# EAGLE schematic ESP_CAM_VVN (EAGLE 9.6.2)
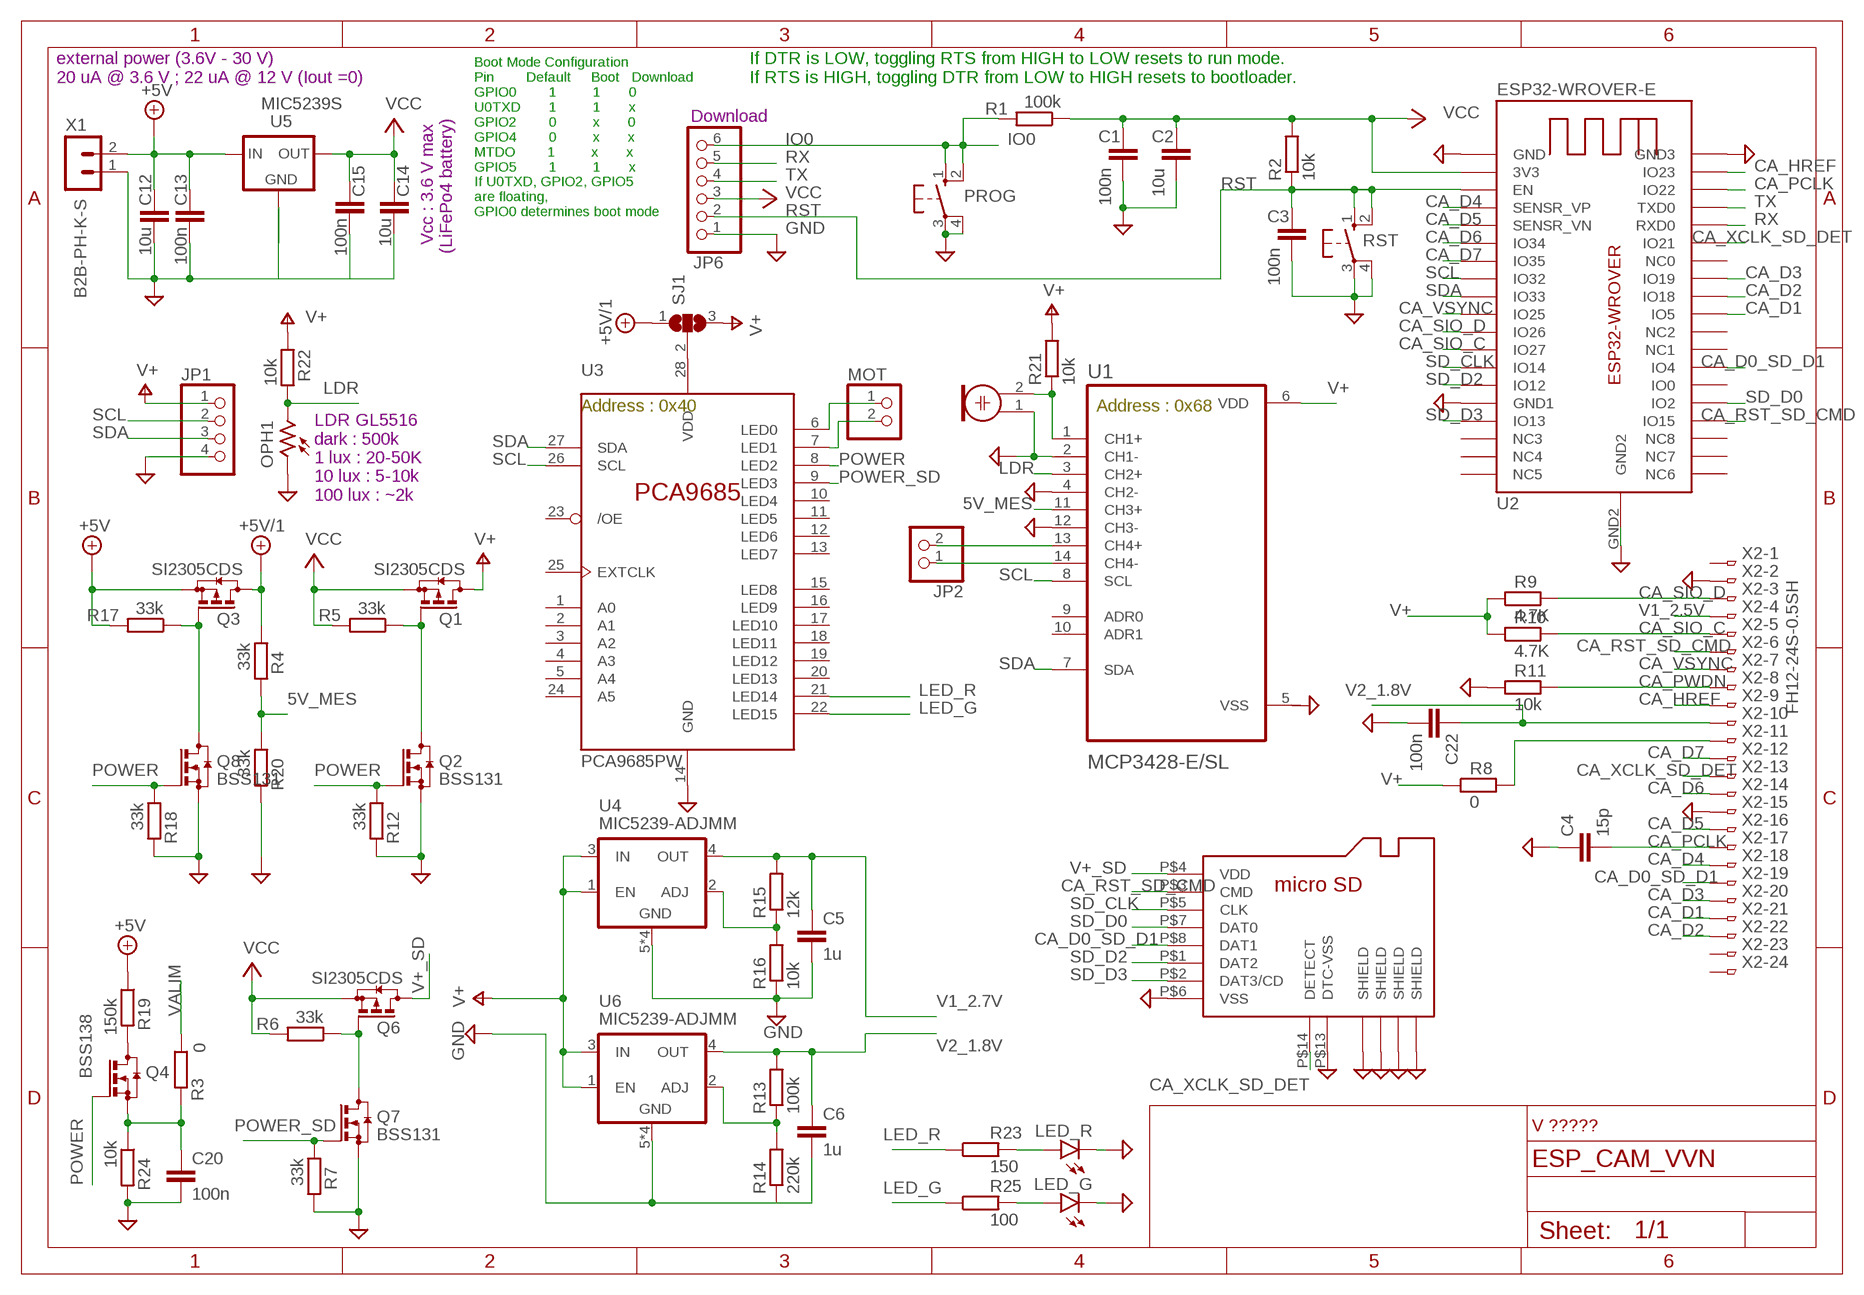
[diagram p0: schematic, sheet 1]

## Parts
C1  100n  CC1206  [C1206]
C2  10u  CC1210  [C1210]
C3  100n  CC1206  [C1206]
C4  15p  CC1206  [C1206]
C5  1u  C-EUC1210K  [C1210K]
C6  1u  C-EUC1210K  [C1210K]
C12  10u  CC1210  [C1210]
C13  100n  CC1206  [C1206]
C14  10u  CC1210  [C1210]
C15  100n  CC1206  [C1206]
C20  100n  CC1206  [C1206]
C22  100n  CC1206  [C1206]
JP1  PINHD-1X4  [1X04]
JP2  PINHD-1X2  [1X02]
JP6  PINHD-1X6  [1X06]
LED_G  LEDSMT1206  [1206]
LED_R  LEDSMT1206  [1206]
M1  ELECTRET_MICROPHON-WM-62PC/62PK  [WM-62PC/62PK]
MOT  PINHD-1X2  [1X02]
OPH1  VT93N2  [VT900]
PROG  10-XX  [B3F-10XX]
Q1  SI2305CDS  [SOT23]
Q2  BSS131  [SOT23]
Q3  SI2305CDS  [SOT23]
Q4  BSS138  [SOT23]
Q6  SI2305CDS  [SOT23]
Q7  BSS131  [SOT23]
Q8  BSS131  [SOT23]
R1  100k  RR1206  [R1206]
R2  10k  RR1206  [R1206]
R3  0  RR1206  [R1206]
R4  33k  RR1206  [R1206]
R5  33k  RR1206  [R1206]
R6  33k  RR1206  [R1206]
R7  33k  RR1206  [R1206]
R8  0  RR1206  [R1206]
R9  4.7K  RR1206  [R1206]
R10  4.7K  RR1206  [R1206]
R11  10k  RR1206  [R1206]
R12  33k  RR1206  [R1206]
R13  100k  R-EU_R1206  [R1206]
R14  220k  R-EU_R1206  [R1206]
R15  12k  R-EU_R1206  [R1206]
R16  10k  R-EU_R1206  [R1206]
R17  33k  RR1206  [R1206]
R18  33k  RR1206  [R1206]
R19  150k  RR1206  [R1206]
R20  33k  RR1206  [R1206]
R21  10k  RR1206  [R1206]
R22  10k  RR1206  [R1206]
R23  150  RR1206  [R1206]
R24  10k  RR1206  [R1206]
R25  100  RR1206  [R1206]
RST  10-XX  [B3F-10XX]
SD1  MICRO-SD-8  [MICROSDMOLEX]
SJ1  SJ2W  [SJ_2]
U1  MCP3428-E/SL  [SOIC127P600X175-14N]
U2  ESP32-WROVER-E  [ESP32-WROVER]
U3  PCA9685PW  [TSSOP28]
U4  MIC5239-ADJMM  [MSOP08]
U5  MIC5239S  [SOT223]
U6  MIC5239-ADJMM  [MSOP08]
X1  B2B-PH-K-S  [B2B-PH-K-S]
X2  FH12-24S-0.5SH  [FH12-24S-0.5SH]

## Nets
5V_MES: R4.2 R20.1 U1.11(CH3+)
+5V: C12.1 C13.1 Q3.2(S) R17.2 R19.1 U5.1(IN) X1.2
+5V/1: Q3.3(D) R4.1 SJ1.1
CA_D0_SD_D1: SD1.P$8(DAT1) U2.IO4 X2.19
CA_D1: U2.IO5 X2.21
CA_D2: U2.IO18 X2.22
CA_D3: U2.IO19 X2.20
CA_D4: U2.SENSOR_VP(SENSR_VP) X2.18
CA_D5: U2.SENSOR_VN(SENSR_VN) X2.16
CA_D6: U2.IO34 X2.14
CA_D7: U2.IO35 X2.12
CA_HREF: U2.IO23 X2.9
CA_PCLK: C4.2 U2.IO22 X2.17
CA_PWDN: R11.2 X2.8
CA_RST_SD_CMD: SD1.P$3(CMD) U2.IO15 X2.6
CA_SIO_C: R10.2 U2.IO27 X2.5
CA_SIO_D: R9.2 U2.IO26 X2.3
CA_VSYNC: U2.IO25 X2.7
CA_XCLK_SD_DET: SD1.P$14(DETECT) U2.IO21 X2.13
GND: C1.2 C2.2 C3.2 C4.1 C5.2 C6.2 C12.2 C13.2 C14.2 C15.2 C20.2 C22.2 JP1.4 JP6.1 LED_G.C LED_R.C M1.1 OPH1.1 PROG.3(P) PROG.4(P1) Q2.2(S) Q7.2(S) Q8.2(S) R7.2 R11.1 R12.2 R14.1 R16.1 R18.2 R20.2 R24.2 RST.3(P) RST.4(P1) SD1.P$6(VSS) SD1.P$9(SHIELD) SD1.P$10(SHIELD) SD1.P$11(SHIELD) SD1.P$12(SHIELD) SD1.P$13(DTC-VSS) U1.2(CH1-) U1.4(CH2-) U1.12(CH3-) U2.GND U2.GND1 U2.GND2 U2.GND3 U3.14(GND) U4.5(GND) U4.6(GND) U4.7(GND) U4.8(GND) U5.2(GND) U5.4(GND) U6.5(GND) U6.6(GND) U6.7(GND) U6.8(GND) X1.1 X2.2 X2.15
IO0: JP6.6 PROG.1(S) PROG.2(S1) R1.2
LDR: OPH1.2 R22.2 U1.3(CH2+)
LED_G: R25.1 U3.22(LED15)
LED_R: R23.1 U3.21(LED14)
N$1: Q1.1(G) Q2.3(D) R5.1
N$2: Q4.3(D) R19.2
N$3: C20.1 Q4.2(S) R3.2 R24.1
N$4: SJ1.2 U3.28(VDD)
N$5: JP2.2 U1.13(CH4+)
N$6: Q6.1(G) Q7.3(D) R6.1
N$7: LED_R.A R23.2
N$8: LED_G.A R25.2
N$9: Q3.1(G) Q8.3(D) R17.1
N$10: R8.2 X2.11
N$11: M1.2 R21.1 U1.1(CH1+)
N$12: JP2.1 U1.14(CH4-)
N$13: MOT.1 U3.6(LED0)
N$14: MOT.2 U3.7(LED1)
N$91: R13.1 R14.2 U6.2(ADJ)
N$92: R15.1 R16.2 U4.2(ADJ)
POWER: Q2.1(G) Q4.1(G) Q8.1(G) R12.1 R18.1 U3.8(LED2)
POWER_SD: Q7.1(G) R7.1 U3.9(LED3)
RST: C3.1 JP6.2 R2.1 RST.1(S) RST.2(S1) U2.EN
RX: JP6.5 U2.RXD0
SCL: JP1.2 U1.8(SCL) U2.IO32 U3.26(SCL)
SD_CLK: SD1.P$5(CLK) U2.IO14
SD_D0: SD1.P$7(DAT0) U2.IO2
SD_D2: SD1.P$1(DAT2) U2.IO12
SD_D3: SD1.P$2(DAT3/CD) U2.IO13
SDA: JP1.3 U1.7(SDA) U2.IO33 U3.27(SDA)
TX: JP6.4 U2.TXD0
V1_2.5V: X2.4
V1_2.7V: C5.1 R15.2 U4.4(OUT)
V2_1.8V: C6.1 C22.1 R13.2 U6.4(OUT) X2.10
V+: JP1.1 Q1.3(D) R8.1 R9.1 R10.1 R21.2 R22.1 SJ1.3 U1.6(VDD) U4.1(EN) U4.3(IN) U6.1(EN) U6.3(IN)
V+_SD: Q6.3(D) SD1.P$4(VDD)
VALIM: R3.1
VCC: C1.1 C2.1 C14.1 C15.1 JP6.3 Q1.2(S) Q6.2(S) R1.1 R2.2 R5.2 R6.2 U2.VDD33(3V3) U5.3(OUT)
Unconnected: U1.9(ADR0) U1.10(ADR1) U2.CLK(NC3) U2.CMD(NC4) U2.IO0 U2.NC0 U2.NC1 U2.NC2 U2.SD0(NC5) U2.SD1(NC6) U2.SD2(NC7) U2.SD3(NC8) U3.1(A0) U3.2(A1) U3.3(A2) U3.4(A3) U3.5(A4) U3.10(LED4) U3.11(LED5) U3.12(LED6) U3.13(LED7) U3.15(LED8) U3.16(LED9) U3.17(LED10) U3.18(LED11) U3.19(LED12) U3.20(LED13) U3.23(/OE) U3.24(A5) U3.25(EXTCLK) X2.1 X2.23 X2.24

## Notes on the sheet
- external power (3.6V - 30 V)
  20 uA @ 3.6 V ; 22 uA @ 12 V (Iout =0)
- If DTR is LOW, toggling RTS from HIGH to LOW resets to run mode.
  If RTS is HIGH, toggling DTR from LOW to HIGH resets to bootloader.
- Download
- Vcc : 3.6 V max 
  (LiFePo4 battery)
- Boot Mode Configuration
  Pin        Default     Boot   Download
  GPIO0        1         1       0
  U0TXD       1         1       x
  GPIO2        0         x       0
  GPIO4        0         x       x
  MTDO        1         x       x
  GPIO5        1         1       x
  If U0TXD, GPIO2, GPIO5 
  are floating, 
  GPIO0 determines boot mode
- Address : 0x40 | Address : 0x68
- LDR GL5516
  dark : 500k
  1 lux : 20-50K
  10 lux : 5-10k
  100 lux : ~2k
- V ?????

## Power pins joined to a net without a drawn wire
VSS: U1.5(VSS)

## Library data of the parts
C1-C4 C12-C15 C20 C22 = eagle-ltspice:C: CAPACITOR, European symbol; SPICEMODEL: NONE; SPICEPREFIX: C
C5 C6 = rcl:C-EU: CAPACITOR, European symbol; SPICEPREFIX: C
JP1 = pinhead:PINHD-1X4: PIN HEADER
JP2 MOT = pinhead:PINHD-1X2: PIN HEADER
JP6 = pinhead:PINHD-1X6: PIN HEADER
LED_G LED_R = led:LED: LED OSRAM: - CHIPLED LG R971, LG N971, LY N971, LG Q971, LY Q971, LO R971, LY R971 LH N974, LH R974 LS Q976, LO Q976, LY Q976 LO Q996 - Hyper CHIPLED LW Q18S LB Q993, LB Q99A, LB R99A - SideLED LS A670, LO A670, LY A670, LG A670, LP A670 LB A673, LV A673, LT A673, LW A673 LH A674 LY A675 LS A676, LA A676, LO A676, LY A676, LW A676 LS A679, LY A679, LG A679 - Hyper Micro SIDELED® LS Y876, LA Y876, LO Y876, LY Y876 LT Y87S - SmartLED LW L88C, LW L88S LB L89C, LB L89S, LG L890 LS L89K, LO L89K, LY L89K LS L896, LA L896, LO L896, LY L896 - TOPLED LS T670, LO T670, LY T670, LG T670, LP T670 LSG T670, LSP T670, LSY T670, LOP T670, LYG T670 LG T671, LOG T671, LSG T671 LB T673, LV T673, LT T673, LW T673 LH T674 LS T676, LA T676, LO T676, LY T676, LB T676, LH T676, LSB T676, LW T676 LB T67C, LV T67C, LT T67C, LS T67K, LO T67K, LY T67K, LW E67C LS E67B, LA E67B, LO E67B, LY E67B, LB E67C, LV E67C, LT E67C LW T67C LS T679, LY T679, LG T679 LS T770, LO T770, LY T770, LG T770, LP T770 LB T773, LV T773, LT T773, LW T773 LH T774 LS E675, LA E675, LY E675, LS T675 LS T776, LA T776, LO T776, LY T776, LB T776 LHGB T686 LT T68C, LB T68C - Hyper Mini TOPLED® LB M676 - Mini TOPLED Santana® LG M470 LS M47K, LO M47K, LY M47K Source: http://www.osram.convergy.de LUXEON: - LUMILED® LXK2-PW12-R00, LXK2-PW12-S00, LXK2-PW14-U00, LXK2-PW14-V00 LXK2-PM12-R00, LXK2-PM12-S00, LXK2-PM14-U00 LXK2-PE12-Q00, LXK2-PE12-R00, LXK2-PE12-S00, LXK2-PE14-T00, LXK2-PE14-U00 LXK2-PB12-K00, LXK2-PB12-L00, LXK2-PB12-M00, LXK2-PB14-N00, LXK2-PB14-P00, LXK2-PB14-Q00 LXK2-PR12-L00, LXK2-PR12-M00, LXK2-PR14-Q00, LXK2-PR14-R00 LXK2-PD12-Q00, LXK2-PD12-R00, LXK2-PD12-S00 LXK2-PH12-R00, LXK2-PH12-S00 LXK2-PL12-P00, LXK2-PL12-Q00, LXK2-PL12-R00 Source: www.luxeon.com KINGBRIGHT: KA-3528ASYC Source: www.kingbright.com
M1 = microphon:ELECTRET_MICROPHON-: Electret Condenser Microphone
OPH1 = photo-elements:VT9: Photoconductive Cell VT900 Series Source: http://optoelectronics.perkinelmer.com/content/Datasheets/DTS_vt900seriesdatasheet.pdf
PROG RST = switch-omron:10-XX: OMRON SWITCH; MPN: B3F-1000; OC_FARNELL: 176432; OC_NEWARK: 36M3542
Q1 Q3 Q6 = transistor-small-signal-perso:SI2305CDS: P-CHANNEL MOS FET
Q2 Q7 Q8 = transistor-small-signal-perso:BSS131: N-CHANNEL MOS FET
Q4 = detect:BSS138: N-CHANNEL MOS FET
R1-R12 R17-R25 = eagle-ltspice:R: RESISTOR, European symbol; SPICEMODEL: NONE; SPICEPREFIX: R
R13-R16 = rcl:R-EU_: RESISTOR, European symbol; SPICEPREFIX: R
SD1 = micro-sd_cp:MICRO-SD-8: Connecteur de carte mémoire microSD de Molex - Séries 503398 et 504077
SJ1 = jumper:SJ2W: SMD solder JUMPER
U1 = MCP3428-E_SL:MCP3428-E/SL: Check prices <https://pricing.snapeda.com/parts/MCP3428-E/SL/Microchip/view-part?ref=eda>; AVAILABILITY: In Stock; DESCRIPTION: 16 Bit Analog to Digital Converter 4 Input 1 Sigma-Delta 14-SOIC; MF: Microchip; MP: MCP3428-E/SL; PACKAGE: SOIC-14 Microchip; PRICE: None; PURCHASE-URL: https://pricing.snapeda.com/search/part/MCP3428-E/SL/?ref=eda
U2 = 32teeth - ESP32-WROVER:ESP32-WROVER-E: ESP32-WROVER-E
U3 = i2c-led-controller:PCA9685
U4 U6 = micrel:MIC5239-ADJ: LDO REGULATOR
U5 = micrel:MIC5239S: LDO REGULATOR
X1 = con-JST PH:B2B-PH: JST PH series header 2.00mm pitch disconnectable crimp style connectors, vertical (side entry type), 2 pins
X2 = con-hirose:FH12-24S-0.5S: 0.5mm Pitch Connectors For FPC/FFC Source: Data sheet <http://www.hirose.co.jp/cataloge_hp/e58605370.pdf>; MPN: FH12-24S-0.5SH(55); OC_FARNELL: 1324552; OC_NEWARK: 34M6170